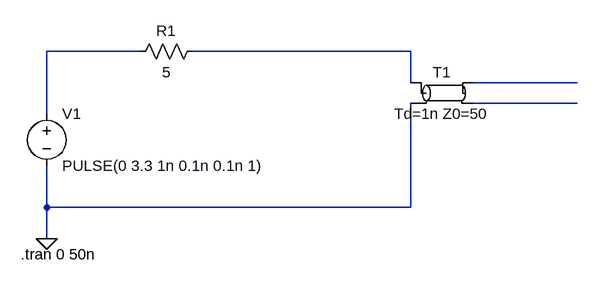
[diagram p0: schematic Q4.asc]
Q4.asc, the LTspice schematic file:
Version 4.1
SHEET 1 1012 680
WIRE 336 -16 192 -16
WIRE 752 -16 416 -16
WIRE 752 32 752 -16
WIRE 1008 32 848 32
WIRE 1008 64 848 64
WIRE 192 80 192 -16
WIRE 192 224 192 160
WIRE 752 224 752 64
WIRE 752 224 192 224
WIRE 192 272 192 224
FLAG 192 272 0
SYMBOL voltage 192 64 R0
WINDOW 123 0 0 Left 0
WINDOW 39 0 0 Left 0
SYMATTR InstName V1
SYMATTR Value PULSE(0 3.3 1n 0.1n 0.1n 1)
SYMBOL res 432 -32 R90
WINDOW 0 0 56 VBottom 2
WINDOW 3 32 56 VTop 2
SYMATTR InstName R1
SYMATTR Value 5
SYMBOL tline 800 48 R0
SYMATTR InstName T1
SYMATTR Value Td=1n Z0=50
TEXT 152 296 Left 2 !.tran 0 50n

The netlist it stands for:
* Q4.asc
V1 N001 0 PULSE(0 3.3 1n 0.1n 0.1n 1)
R1 N002 N001 5
T1 N002 0 N003 N004 Td=1n Z0=50
.tran 0 50n
.backanno
.end